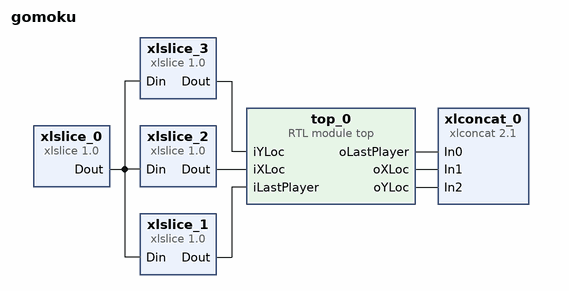
[diagram p0: block diagram of the top level]
# Vivado block design gomoku, Vivado 2016.2
create_bd_design gomoku

create_bd_cell -type module -reference top top_0
create_bd_cell -type ip -vlnv xilinx.com:ip:xlconcat:2.1 xlconcat_0
set_property -dict {CONFIG.NUM_PORTS 3 CONFIG.IN0_WIDTH 1 CONFIG.IN1_WIDTH 4 CONFIG.IN2_WIDTH 4} [get_bd_cells xlconcat_0]
create_bd_cell -type ip -vlnv xilinx.com:ip:xlslice:1.0 xlslice_0
set_property -dict {CONFIG.DOUT_WIDTH 9 CONFIG.DIN_TO 0 CONFIG.DIN_FROM 8} [get_bd_cells xlslice_0]
create_bd_cell -type ip -vlnv xilinx.com:ip:xlslice:1.0 xlslice_1
set_property -dict {CONFIG.DIN_TO 0 CONFIG.DIN_FROM 0 CONFIG.DIN_WIDTH 9} [get_bd_cells xlslice_1]
create_bd_cell -type ip -vlnv xilinx.com:ip:xlslice:1.0 xlslice_2
set_property -dict {CONFIG.DOUT_WIDTH 4 CONFIG.DIN_TO 1 CONFIG.DIN_FROM 4 CONFIG.DIN_WIDTH 9} [get_bd_cells xlslice_2]
create_bd_cell -type ip -vlnv xilinx.com:ip:xlslice:1.0 xlslice_3
set_property -dict {CONFIG.DOUT_WIDTH 4 CONFIG.DIN_TO 5 CONFIG.DIN_FROM 8 CONFIG.DIN_WIDTH 9} [get_bd_cells xlslice_3]

# ---- connections ----

connect_bd_net [get_bd_pins top_0/oLastPlayer] [get_bd_pins xlconcat_0/In0]
connect_bd_net [get_bd_pins top_0/oXLoc] [get_bd_pins xlconcat_0/In1]
connect_bd_net [get_bd_pins top_0/oYLoc] [get_bd_pins xlconcat_0/In2]
connect_bd_net [get_bd_pins xlslice_0/Dout] [get_bd_pins xlslice_3/Din] [get_bd_pins xlslice_2/Din] [get_bd_pins xlslice_1/Din]
connect_bd_net [get_bd_pins xlslice_1/Dout] [get_bd_pins top_0/iLastPlayer]
connect_bd_net [get_bd_pins xlslice_2/Dout] [get_bd_pins top_0/iXLoc]
connect_bd_net [get_bd_pins xlslice_3/Dout] [get_bd_pins top_0/iYLoc]

validate_bd_design
save_bd_design
